# Altium schematic sheet SHIELD_TRF7960A.SchDoc
size A2
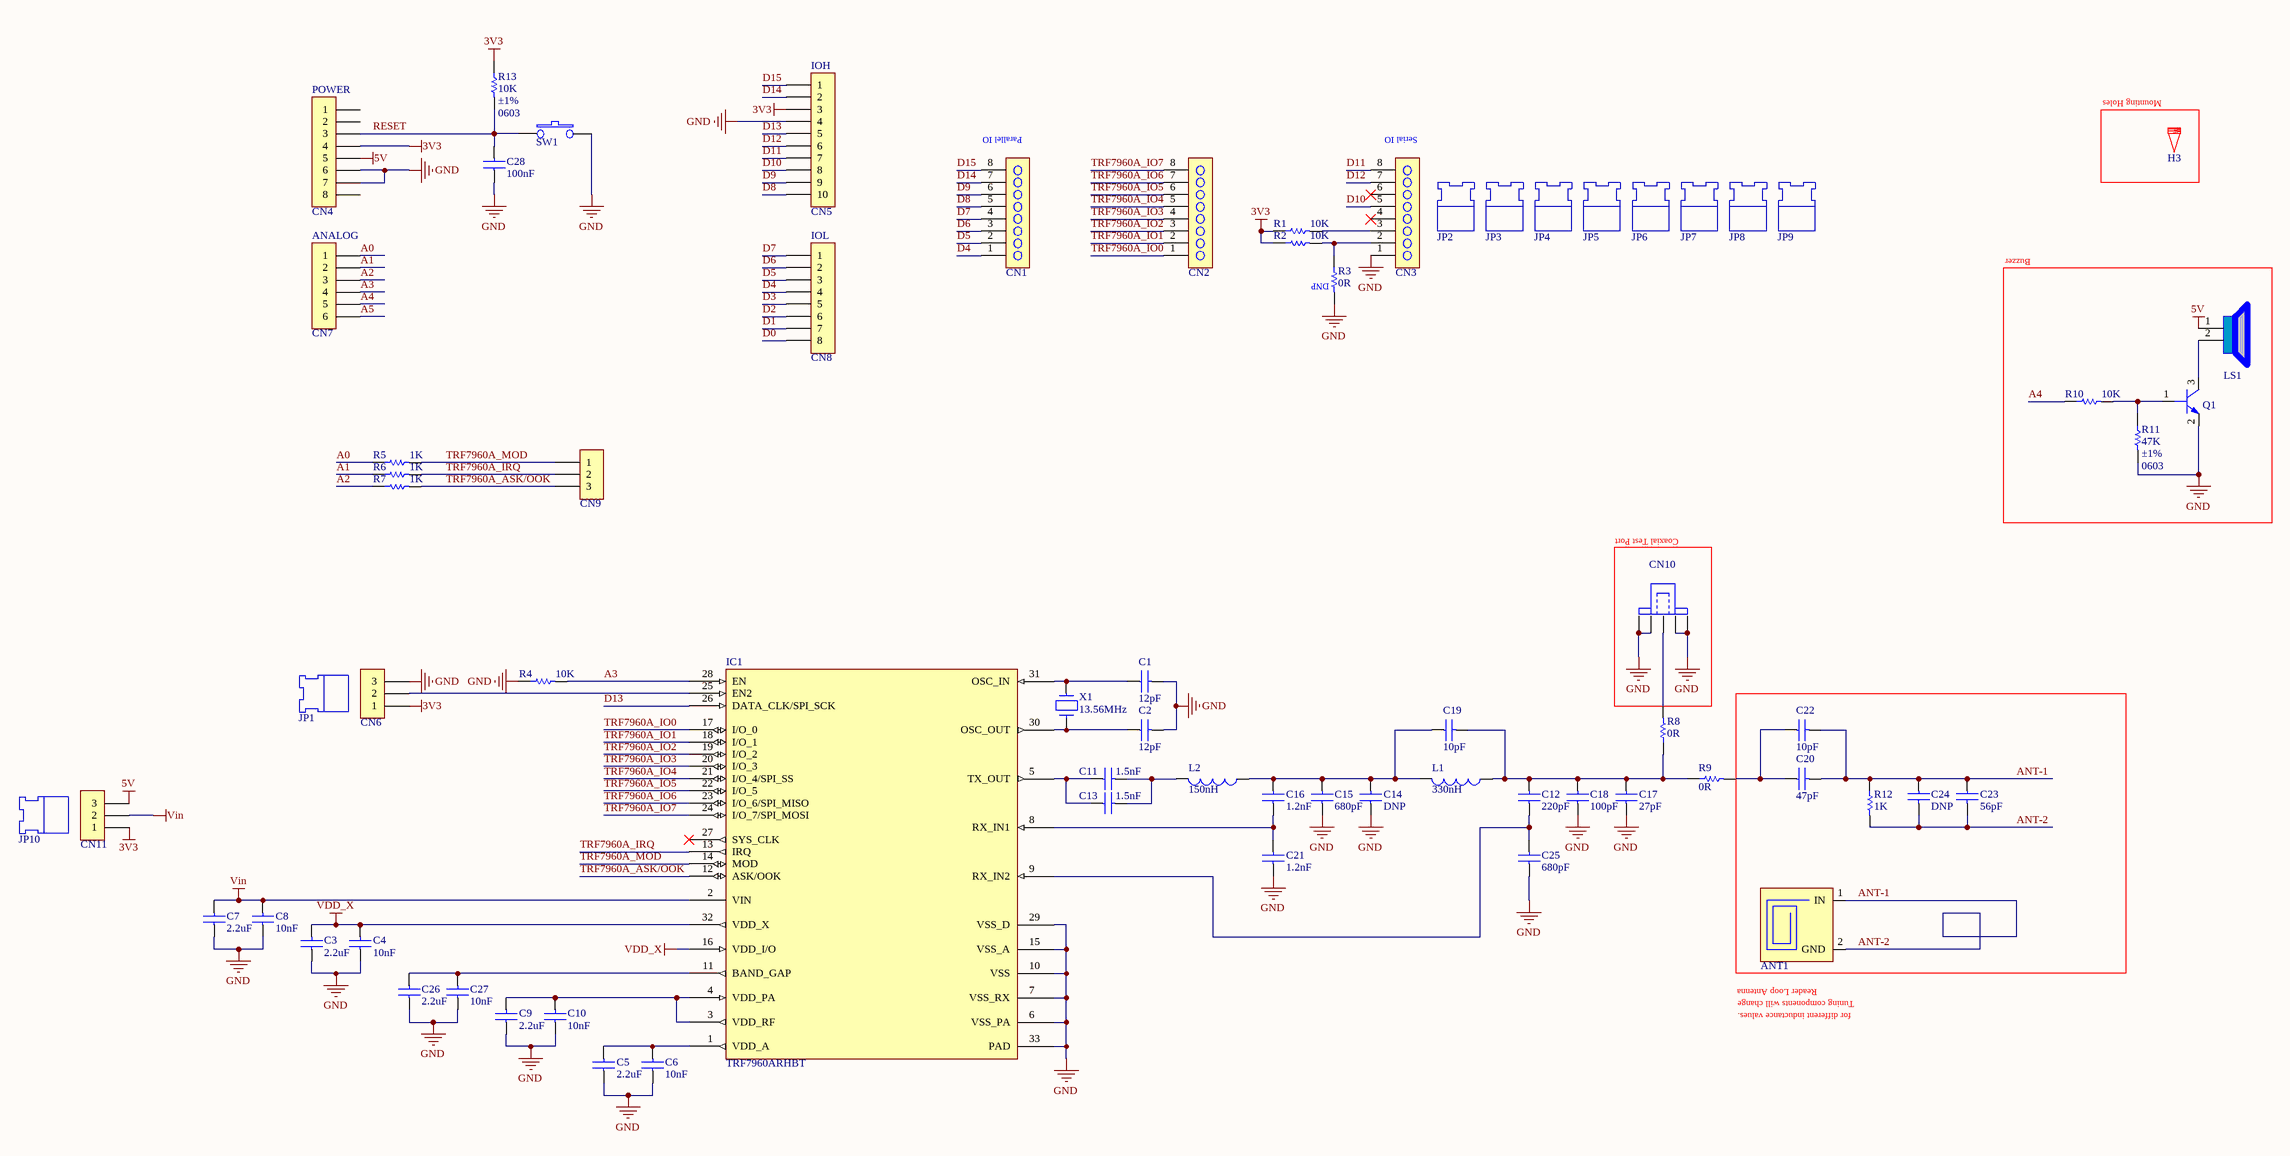
[diagram p0: SHIELD_TRF7960A.SchDoc]

## Parts
ANT1  ANTENNA_LOOP  [ANTENNA_LOOP]  (value not drawn)
C1  value 12pF  [CAPC1608X90N_EIA0603]  (hidden comment: CAP_NP)
C2  value 12pF  [CAPC1608X90N_EIA0603]  (hidden comment: CAP_NP)
C3  value 2.2uF  [CAPC1608X90N_EIA0603]  (hidden comment: CAP_NP)
C4  value 10nF  [CAPC1608X90N_EIA0603]  (hidden comment: CAP_NP)
C5  value 2.2uF  [CAPC1608X90N_EIA0603]  (hidden comment: CAP_NP)
C6  value 10nF  [CAPC1608X90N_EIA0603]  (hidden comment: CAP_NP)
C7  value 2.2uF  [CAPC1608X90N_EIA0603]  (hidden comment: CAP_NP)
C8  value 10nF  [CAPC1608X90N_EIA0603]  (hidden comment: CAP_NP)
C9  value 2.2uF  [CAPC1608X90N_EIA0603]  (hidden comment: CAP_NP)
C10  value 10nF  [CAPC1608X90N_EIA0603]  (hidden comment: CAP_NP)
C11  value 1.5nF  [CAPC1608X90N_EIA0603]  (hidden comment: CAP_NP)
C12  value 220pF  [CAPC1608X90N_EIA0603]  (hidden comment: CAP_NP)
C13  value 1.5nF  [CAPC1608X90N_EIA0603]  (hidden comment: CAP_NP)
C14  value DNP  [CAPC1608X90N_EIA0603]  (hidden comment: CAP_NP)
C15  value 680pF  [CAPC1608X90N_EIA0603]  (hidden comment: CAP_NP)
C16  value 1.2nF  [CAPC1608X90N_EIA0603]  (hidden comment: CAP_NP)
C17  value 27pF  [CAPC1608X90N_EIA0603]  (hidden comment: CAP_NP)
C18  value 100pF  [CAPC1608X90N_EIA0603]  (hidden comment: CAP_NP)
C19  value 10pF  [CAPC1608X90N_EIA0603]  (hidden comment: CAP_NP)
C20  value 47pF  [CAPC1608X90N_EIA0603]  (hidden comment: CAP_NP)
C21  value 1.2nF  [CAPC1608X90N_EIA0603]  (hidden comment: CAP_NP)
C22  value 10pF  [CAPC1608X90N_EIA0603]  (hidden comment: CAP_NP)
C23  value 56pF  [CAPC1608X90N_EIA0603]  (hidden comment: CAP_NP)
C24  value DNP  [CAPC1608X90N_EIA0603]  (hidden comment: CAP_NP)
C25  value 680pF  [CAPC1608X90N_EIA0603]  (hidden comment: CAP_NP)
C26  value 2.2uF  [CAPC1608X90N_EIA0603]  (hidden comment: CAP_NP)
C27  value 10nF  [CAPC1608X90N_EIA0603]  (hidden comment: CAP_NP)
C28  value 100nF  [CAPC1608X90N_EIA0603]  (hidden comment: CAP_NP)
CN1  HDRV_1X8  [HDRV8W64P254_1X8_2032X254X600P]  (value not drawn)
CN2  HDRV_1X8  [HDRV8W64P254_1X8_2032X254X600P]  (value not drawn)
CN3  HDRV_1X8  [HDRV8W64P254_1X8_2032X254X600P]  (value not drawn)
CN4  HDR_1X8  [HDRFV8W70P254_1X8_2032X254X1118P]  (value not drawn)
CN5  HDR_1X10  [HDRFV10W70P254_1X10_2540X254X1118P]  (value not drawn)
CN6  HDR_1X3  [HDRV3W64P254_1X3_762X254X600P]  (value not drawn)
CN7  HDR_1X6  [HDRFV6W70P254_1X6_1524X254X1118P]  (value not drawn)
CN8  HDR_1X8  [HDRFV8W70P254_1X8_2032X254X1118P]  (value not drawn)
CN9  HDR_1X3  [HDRV3W64P254_1X3_762X254X600P]  (value not drawn)
CN10  SMA  [EMERSON_142-0701-201]  (value not drawn)
CN11  HDR_1X3  [HDRV3W64P254_1X3_762X254X600P]  (value not drawn)
H3  HOLES  [HOLE_125MIL]  (value not drawn)
IC1  Manufacturer Part Number: TRF7960ARHBT  [QFN50P350X500X90_HS-33N]  (hidden comment: TRF7960A)
JP1  JUMPER  [JUMPER254P]  (value not drawn)
JP2  JUMPER  [JUMPER254P]  (value not drawn)
JP3  JUMPER  [JUMPER254P]  (value not drawn)
JP4  JUMPER  [JUMPER254P]  (value not drawn)
JP5  JUMPER  [JUMPER254P]  (value not drawn)
JP6  JUMPER  [JUMPER254P]  (value not drawn)
JP7  JUMPER  [JUMPER254P]  (value not drawn)
JP8  JUMPER  [JUMPER254P]  (value not drawn)
JP9  JUMPER  [JUMPER254P]  (value not drawn)
JP10  JUMPER  [JUMPER254P]  (value not drawn)
L1  value 330nH  [INDC2115X13N_EIA0805]  (hidden comment: INDUCTOR)
L2  value 150nH  [INDC2115X13N_EIA0805]  (hidden comment: INDUCTOR)
LS1  BUZZER  [BUZZER_12MM]  (value not drawn)
Q1  BC817  [SOT95P230X110-3N_SOT-23]  (value not drawn)
R1  value 10K  [RESC1608X50N_EIA0603]  (hidden comment: RES)
R2  value 10K  [RESC1608X50N_EIA0603]  (hidden comment: RES)
R3  value 0R  [RESC1608X50N_EIA0603]  (hidden comment: RES)
R4  value 10K  [RESC1608X50N_EIA0603]  (hidden comment: RES)
R5  value 1K  [RESC1608X50N_EIA0603]  (hidden comment: RES)
R6  value 1K  [RESC1608X50N_EIA0603]  (hidden comment: RES)
R7  value 1K  [RESC1608X50N_EIA0603]  (hidden comment: RES)
R8  value 0R  [RESC1608X50N_EIA0603]  (hidden comment: RES)
R9  value 0R  [RESC1608X50N_EIA0603]  (hidden comment: RES)
R10  value 10K  [RESC1608X50N_EIA0603]  (hidden comment: RES)
R11  value 47K  Tolerance: ±1%  Package / Case: 0603  [RESC1608X50N_EIA0603]  (hidden comment: RES)
R12  value 1K  [RESC1608X50N_EIA0603]  (hidden comment: RES)
R13  value 10K  Tolerance: ±1%  Package / Case: 0603  [RESC1608X50N_EIA0603]  (hidden comment: RES)
SW1  SWITCH_TACTILE_2PIN  [C&K_RS-282G05A3-SM_RT]  (value not drawn)
X1  value 13.56MHz  [HC-49/US]  (hidden comment: CRYSTAL)

## Blocks framed on the sheet
Mounting Holes: H3
Buzzer: LS1 Q1 R10 R11
Coaxial Test Port: CN10

## Nets
3V3: CN4.4 CN5.3 CN6.1 CN11.1 R1.1 R2.1 R13.1
5V: CN4.5 CN11.3 LS1.1(+)
GND: C1.2 C2.2 C3.1 C4.1 C5.1 C6.1 C7.1 C8.1 C9.1 C10.1 C14.1 C15.1 C17.1 C18.1 C21.1 C25.1 C26.1 C27.1 C28.1 CN3.1 CN4.6 CN4.7 CN5.4 CN6.3 CN10.2 CN10.3 CN10.4 CN10.5 IC1.6(VSS_PA) IC1.7(VSS_RX) IC1.10(VSS) IC1.15(VSS_A) IC1.29(VSS_D) IC1.33(PAD) Q1.2(E) R3.2 R4.1 R11.2 SW1.2
VDD_X: C3.2 C4.2 IC1.16(VDD_I/O) IC1.32(VDD_X)
Vin: C7.2 C8.2 CN11.2 IC1.2(VIN)
A0: CN7.1 R5.1
A1: CN7.2 R6.1
A2: CN7.3 R7.1
A3: CN7.4 IC1.28(EN) R4.2
A4: CN7.5 R10.1
A5: CN7.6
ANT-1: ANT1.1(IN) ANT1.2(GND) C20.2 C22.2 C23.1 C23.2 C24.1 C24.2 R12.1 R12.2  [also labelled ANT-2]
D0: CN8.8
D1: CN8.7
D2: CN8.6
D3: CN8.5
D4: CN1.1 CN8.4
D5: CN1.2 CN8.3
D6: CN1.3 CN8.2
D7: CN1.4 CN8.1
D8: CN1.5 CN5.10
D9: CN1.6 CN5.9
D10: CN3.5 CN5.8
D11: CN3.8 CN5.7
D12: CN3.7 CN5.6
D13: CN5.5 IC1.26(DATA_CLK/SPI_SCK)
D14: CN1.7 CN5.2
D15: CN1.8 CN5.1
RESET: C28.2 CN4.3 R13.2 SW1.1
TRF7960A_ASK/OOK: CN9.3 IC1.12(ASK/OOK) R7.2
TRF7960A_IO0: CN2.1 IC1.17(I/O_0)
TRF7960A_IO1: CN2.2 IC1.18(I/O_1)
TRF7960A_IO2: CN2.3 IC1.19(I/O_2)
TRF7960A_IO3: CN2.4 IC1.20(I/O_3)
TRF7960A_IO4: CN2.5 IC1.21(I/O_4/SPI_SS)
TRF7960A_IO5: CN2.6 IC1.22(I/O_5)
TRF7960A_IO6: CN2.7 IC1.23(I/O_6/SPI_MISO)
TRF7960A_IO7: CN2.8 IC1.24(I/O_7/SPI_MOSI)
TRF7960A_IRQ: CN9.2 IC1.13(IRQ) R6.2
TRF7960A_MOD: CN9.1 IC1.14(MOD) R5.2
NetC1_1: C1.1 IC1.31(OSC_IN) X1.1
NetC2_1: C2.1 IC1.30(OSC_OUT) X1.2
NetC5_2: C5.2 C6.2 IC1.1(VDD_A)
NetC9_2: C9.2 C10.2 IC1.3(VDD_RF) IC1.4(VDD_PA)
NetC11_1: C11.1 C13.1 IC1.5(TX_OUT)
NetC11_2: C11.2 C13.2 L2.2
NetC12_1: C12.1 C25.2 IC1.9(RX_IN2)
NetC12_2: C12.2 C17.2 C18.2 C19.2 L1.1 R8.1 R9.1
NetC14_2: C14.2 C15.2 C16.2 C19.1 L1.2 L2.1
NetC16_1: C16.1 C21.2 IC1.8(RX_IN1)
NetC20_1: C20.1 C22.1 R9.2
NetC26_2: C26.2 C27.2 IC1.11(BAND_GAP)
NetCN3_2: CN3.2 R2.2 R3.1
NetCN3_3: CN3.3 R1.2
NetCN6_2: CN6.2 IC1.25(EN2)
NetCN10_1: CN10.1 R8.2
NetLS1_2: LS1.2(-) Q1.3(C)
NetQ1_1: Q1.1(B) R10.2 R11.1

Not connected (* = marked no-connect by the designer): CN3 4* 6*; CN4 1 2 8; IC1 27(SYS_CLK)*

## Notes on the sheet
- (near CN5) IOH
- (near CN4) POWER
- (near CN1) Parallel IO
- (near CN3) Serial IO
- (near CN7) ANALOG
- (near CN8) IOL
- (near R3) DNP
- (near ANT1) Reader Loop Antenna
- Tuning components will change
- for different inductance values.

## Library data of the parts
ANT1 = SMSC00004: ANTENNA LOOP; Part Number: SMSC00004; Value: ANTENNA
C1 C2 = SCAP00200035: CAP CER 12PF 50V NP0 0603; Manufacturer: Murata Electronics North America; Manufacturer Part Number: GRM1885C1H120JA01D; Tolerance: ±5%; Temperature Coefficient: C0G, NP0; Type: Multi Layer Ceramic Capacitor  (MLCC); Cost x1 ($): 0.10000; Cost x10 ($): 0.04100; Cost x100 ($): 0.01870; Cost x1000 ($): 0.01020; Distrubutor: Digikey; Lead Time: 19 Weeks; Part Number: SCAP00200035; Capacitance: 12pF; Voltage - Rated: 50V; Package / Case: 0603; Operating Temperature: -55°C ~ 125°C; Mounting Type: Surface Mount, MLCC; Size / Dimension: 0.063" L x 0.031" W (1.60mm x 0.80mm); Category: Capacitors; Family: Ceramic Capacitors; Distributor Part Number: 490-1405-1-ND; Distributor Link: http://www.digikey.com/product-detail/en/murata-electronics-north-america/GRM1885C1H120JA01D/490-1405-1-ND/587644; ROHS: YES; Moisture Sensitivity Level (MSL): 1 (Unlimited); Quantity: 0
C3 C5 C7 C9 C26 = SCAP00200098: CAP CER 2.2UF 6.3V X5R 0603; Manufacturer: Murata Electronics North America; Manufacturer Part Number: GRM188R60J225KE19D; Capacitance: 2.2µF; Tolerance: ±10%; Type: Multi Layer Ceramic Capacitor  (MLCC); Cost x1 ($): 0.13000; Cost x10 ($): 0.08800; Cost x100 ($): 0.04180; Cost x1000 ($): 0.02420; Distrubutor: Digikey; Lead Time: 19 Weeks; Part Number: SCAP00200098; Voltage - Rated: 6.3V; Package / Case: 0603; Temperature Coefficient: X5R; Operating Temperature: -55°C ~ 85°C; Mounting Type: Surface Mount, MLCC; Size / Dimension: 0.063" L x 0.031" W (1.60mm x 0.80mm); Category: Capacitors; Family: Ceramic Capacitors; Distributor Part Number: 490-1552-1-ND; Distributor Link: http://www.digikey.com/product-detail/en/murata-electronics-north-america/GRM188R60J225KE19D/490-1552-1-ND/587757; ROHS: YES; Moisture Sensitivity Level (MSL): 1 (Unlimited); Quantity: 0
C4 C6 C8 C10 C27 = SCAP00200083: CAP CER 10000PF 50V X7R 0603; Manufacturer: Murata Electronics North America; Manufacturer Part Number: GRM188R71H103KA01D; Tolerance: ±10%; Type: Multi Layer Ceramic Capacitor  (MLCC); Cost x1 ($): 0.10000; Cost x10 ($): 0.01900; Cost x100 ($): 0.00850; Cost x1000 ($): 0.00465; Distrubutor: Digikey; Lead Time: 19 Weeks; Part Number: SCAP00200083; Capacitance: 10nF; Voltage - Rated: 50V; Package / Case: 0603; Temperature Coefficient: X7R; Operating Temperature: -55°C ~ 125°C; Mounting Type: Surface Mount, MLCC; Size / Dimension: 0.063" L x 0.031" W (1.60mm x 0.80mm); Category: Capacitors; Family: Ceramic Capacitors; Distributor Part Number: 490-1512-1-ND; Distributor Link: http://www.digikey.com/product-detail/en/murata-electronics-north-america/GRM188R71H103KA01D/490-1512-1-ND/587862; ROHS: YES; Moisture Sensitivity Level (MSL): 1 (Unlimited); Quantity: 0
C11 C13 = SCAP00200075: CAP CER 1500PF 50V X7R 0603; Manufacturer: Murata Electronics North America; Manufacturer Part Number: GRM188R71H152KA01D; Tolerance: ±10%; Type: Multi Layer Ceramic Capacitor  (MLCC); Cost x1 ($): 0.10000; Cost x10 ($): 0.03500; Cost x100 ($): 0.01600; Cost x1000 ($): 0.00873; Distrubutor: Digikey; Lead Time: 19 Weeks; Part Number: SCAP00200075; Capacitance: 1.5nF; Voltage - Rated: 50V; Package / Case: 0603; Temperature Coefficient: X7R; Operating Temperature: -55°C ~ 125°C; Mounting Type: SMD; Size / Dimension: 0.063" L x 0.031" W (1.60mm x 0.80mm); Category: Capacitors; Family: Ceramic Capacitors; Distributor Part Number: 490-1498-1-ND; Distributor Link: http://www.digikey.com/product-detail/en/murata-electronics-north-america/GRM188R71H152KA01D/490-1498-1-ND/587878; ROHS: YES; Moisture Sensitivity Level (MSL): 1 (Unlimited); Quantity: 0
C12 = SCAP00200065: CAP CER 220PF 50V NP0 0603; Manufacturer: Murata Electronics North America; Manufacturer Part Number: GRM1885C1H221JA01D; Tolerance: ±5%; Temperature Coefficient: C0G, NP0; Type: Multi Layer Ceramic Capacitor  (MLCC); Cost x1 ($): 0.10000; Cost x10 ($): 0.04100; Cost x100 ($): 0.01870; Cost x1000 ($): 0.01020; Distrubutor: Digikey; Lead Time: 19 Weeks; Part Number: SCAP00200065; Capacitance: 220pF; Voltage - Rated: 50V; Package / Case: 0603; Operating Temperature: -55°C ~ 125°C; Mounting Type: SMD; Size / Dimension: 0.063" L x 0.031" W (1.60mm x 0.80mm); Category: Capacitors; Family: Ceramic Capacitors; Distributor Part Number: 490-1435-1-ND; Distributor Link: http://www.digikey.com/product-detail/en/murata-electronics-north-america/GRM1885C1H221JA01D/490-1435-1-ND/587673; ROHS: YES; Moisture Sensitivity Level (MSL): 1 (Unlimited); Quantity: 0
C14 C24 = SCAP00200000: Type: Multi Layer Ceramic Capacitor  (MLCC); Distrubutor: Digikey; Part Number: SCAP00200000; Capacitance: DNP; Package / Case: 0603; Category: Capacitors; Family: Ceramic Capacitors; ROHS: YES; Quantity: 0
C15 C25 = SCAP00200071: CAP CER 680PF 50V NP0 0603; Manufacturer: Murata Electronics North America; Manufacturer Part Number: GRM1885C1H681JA01D; Tolerance: ±5%; Temperature Coefficient: C0G, NP0; Type: Multi Layer Ceramic Capacitor  (MLCC); Cost x1 ($): 0.10000; Cost x10 ($): 0.06600; Cost x100 ($): 0.03040; Cost x1000 ($): 0.01659; Distrubutor: Digikey; Lead Time: 17 Weeks; Part Number: SCAP00200071; Capacitance: 680pF; Voltage - Rated: 50V; Package / Case: 0603; Operating Temperature: -55°C ~ 125°C; Mounting Type: SMD; Size / Dimension: 0.063" L x 0.031" W (1.60mm x 0.80mm); Category: Capacitors; Family: Ceramic Capacitors; Distributor Part Number: 490-1447-1-ND; Distributor Link: http://www.digikey.com/product-detail/en/murata-electronics-north-america/GRM1885C1H681JA01D/490-1447-1-ND/587664; ROHS: YES; Moisture Sensitivity Level (MSL): 1 (Unlimited); Quantity: 0
C16 C21 = SCAP00200074: CAP CER 1200PF 50V X7R 0603; Manufacturer: Murata Electronics North America; Manufacturer Part Number: GRM188R71H122KA01D; Tolerance: ±10%; Type: Multi Layer Ceramic Capacitor  (MLCC); Cost x1 ($): 0.10000; Cost x10 ($): 0.05600; Cost x100 ($): 0.02590; Cost x1000 ($): 0.01410; Distrubutor: Digikey; Lead Time: 19 Weeks; Part Number: SCAP00200074; Capacitance: 1.2nF; Voltage - Rated: 50V; Package / Case: 0603; Temperature Coefficient: X7R; Operating Temperature: -55°C ~ 125°C; Mounting Type: SMD; Size / Dimension: 0.063" L x 0.031" W (1.60mm x 0.80mm); Category: Capacitors; Family: Ceramic Capacitors; Distributor Part Number: 490-1496-1-ND; Distributor Link: http://www.digikey.com/product-detail/en/murata-electronics-north-america/GRM188R71H122KA01D/490-1496-1-ND/587853; ROHS: YES; Moisture Sensitivity Level (MSL): 1 (Unlimited); Quantity: 0
C17 = SCAP00200043: CAP CER 27PF 50V NP0 0603; Manufacturer: Murata Electronics North America; Manufacturer Part Number: GRM1885C1H270JA01D; Tolerance: ±5%; Temperature Coefficient: C0G, NP0; Type: Multi Layer Ceramic Capacitor  (MLCC); Cost x1 ($): 0.10000; Cost x10 ($): 0.04100; Cost x100 ($): 0.01870; Cost x1000 ($): 0.01020; Distrubutor: Digikey; Lead Time: 19 Weeks; Part Number: SCAP00200043; Capacitance: 27pF; Voltage - Rated: 50V; Package / Case: 0603; Operating Temperature: -55°C ~ 125°C; Mounting Type: SMD; Size / Dimension: 0.063" L x 0.031" W (1.60mm x 0.80mm); Category: Capacitors; Family: Ceramic Capacitors; Distributor Part Number: 490-1413-1-ND; Distributor Link: http://www.digikey.com/product-detail/en/murata-electronics-north-america/GRM1885C1H270JA01D/490-1413-1-ND/587618; ROHS: YES; Moisture Sensitivity Level (MSL): 1 (Unlimited); Quantity: 0
C18 = SCAP00200057: CAP CER 100PF 50V NP0 0603; Manufacturer: Murata Electronics North America; Manufacturer Part Number: GRM1885C1H101JA01D; Tolerance: ±5%; Temperature Coefficient: C0G, NP0; Type: Multi Layer Ceramic Capacitor  (MLCC); Cost x1 ($): 0.10000; Cost x10 ($): 0.03100; Cost x100 ($): 0.01400; Cost x1000 ($): 0.00765; Distrubutor: Digikey; Lead Time: 19 Weeks; Part Number: SCAP00200057; Capacitance: 100pF; Voltage - Rated: 50V; Package / Case: 0603; Operating Temperature: -55°C ~ 125°C; Mounting Type: SMD; Size / Dimension: 0.063" L x 0.031" W (1.60mm x 0.80mm); Category: Capacitors; Family: Ceramic Capacitors; Distributor Part Number: 490-1427-1-ND; Distributor Link: http://www.digikey.com/product-detail/en/murata-electronics-north-america/GRM1885C1H101JA01D/490-1427-1-ND/587633; ROHS: YES; Moisture Sensitivity Level (MSL): 1 (Unlimited); Quantity: 0
C19 C22 = SCAP00200033: CAP CER 10PF 50V NP0 0603; Manufacturer: Murata Electronics North America; Manufacturer Part Number: GCM1885C1H100JA16D; Tolerance: ±5%; Temperature Coefficient: C0G, NP0; Type: Multi Layer Ceramic Capacitor  (MLCC); Cost x1 ($): 0.10000; Cost x10 ($): 0.04200; Cost x100 ($): 0.01930; Cost x1000 ($): 0.01050; Distrubutor: Digikey; Lead Time: 19 Weeks; Part Number: SCAP00200033; Capacitance: 10pF; Voltage - Rated: 50V; Package / Case: 0603; Operating Temperature: -55°C ~ 125°C; Mounting Type: SMD; Size / Dimension: 0.063" L x 0.031" W (1.60mm x 0.80mm); Category: Capacitors; Family: Ceramic Capacitors; Distributor Part Number: 490-4766-1-ND; Distributor Link: http://www.digikey.com/product-detail/en/murata-electronics-north-america/GCM1885C1H100JA16D/490-4766-1-ND/1641685; ROHS: YES; Moisture Sensitivity Level (MSL): 1 (Unlimited); Quantity: 0
C20 = SCAP00200049: CAP CER 47PF 50V NP0 0603; Manufacturer: Murata Electronics North America; Manufacturer Part Number: GRM1885C1H470JA01D; Tolerance: ±5%; Temperature Coefficient: C0G, NP0; Type: Multi Layer Ceramic Capacitor  (MLCC); Cost x1 ($): 0.10000; Cost x10 ($): 0.02900; Cost x100 ($): 0.01320; Cost x1000 ($): 0.00720; Distrubutor: Digikey; Lead Time: 19 Weeks; Part Number: SCAP00200049; Capacitance: 47pF; Voltage - Rated: 50V; Package / Case: 0603; Operating Temperature: -55°C ~ 125°C; Mounting Type: SMD; Size / Dimension: 0.063" L x 0.031" W (1.60mm x 0.80mm); Category: Capacitors; Family: Ceramic Capacitors; Distributor Part Number: 490-1419-1-ND; Distributor Link: http://www.digikey.com/product-detail/en/murata-electronics-north-america/GRM1885C1H470JA01D/490-1419-1-ND/587616; ROHS: YES; Moisture Sensitivity Level (MSL): 1 (Unlimited); Quantity: 0
C23 = SCAP00200051: CAP CER 56PF 50V NP0 0603; Manufacturer: Murata Electronics North America; Manufacturer Part Number: GRM1885C1H560JA01D; Tolerance: ±5%; Temperature Coefficient: C0G, NP0; Type: Multi Layer Ceramic Capacitor  (MLCC); Cost x1 ($): 0.10000; Cost x10 ($): 0.04100; Cost x100 ($): 0.01870; Cost x1000 ($): 0.01020; Distrubutor: Digikey; Lead Time: 19 Weeks; Part Number: SCAP00200051; Capacitance: 56pF; Voltage - Rated: 50V; Package / Case: 0603; Operating Temperature: -55°C ~ 125°C; Mounting Type: SMD; Size / Dimension: 0.063" L x 0.031" W (1.60mm x 0.80mm); Category: Capacitors; Family: Ceramic Capacitors; Distributor Part Number: 490-1421-1-ND; Distributor Link: http://www.digikey.com/product-detail/en/murata-electronics-north-america/GRM1885C1H560JA01D/490-1421-1-ND/587626; ROHS: YES; Moisture Sensitivity Level (MSL): 1 (Unlimited); Quantity: 0
C28 = SCAP00200091: CAP CER 0.1UF 16V X7R 0603; Manufacturer: Murata Electronics North America; Manufacturer Part Number: GRM188R71C104KA01D; Tolerance: ±10%; Type: Multi Layer Ceramic Capacitor  (MLCC); Cost x1 ($): 0.10000; Cost x10 ($): 0.01900; Cost x100 ($): 0.00860; Cost x1000 ($): 0.00468; Distrubutor: Digikey; Lead Time: 11 Weeks; Part Number: SCAP00200091; Capacitance: 100nF; Voltage - Rated: 16V; Package / Case: 0603; Temperature Coefficient: X7R; Operating Temperature: -55°C ~ 125°C; Mounting Type: Surface Mount, MLCC; Size / Dimension: 0.063" L x 0.031" W (1.60mm x 0.80mm); Category: Capacitors; Family: Ceramic Capacitors; Distributor Part Number: 490-1532-1-ND; Distributor Link: http://www.digikey.com/product-detail/en/murata-electronics-north-america/GRM188R71C104KA01D/490-1532-1-ND/587771; ROHS: YES; Moisture Sensitivity Level (MSL): 1 (Unlimited); Quantity: 0
CN1-CN3 = SCON00132: CONN HEADER 8POS .100 VERT TIN; Manufacturer: Harwin Inc.; Manufacturer Part Number: M20-9990846; Value: HDR_M_1X8_254; Pitch: 2.54mm; Connector Type: Male Pin; Distrubutor: Digikey; Lead Time: 6 Weeks; Cost x1 ($): 0.23000; Cost x10 ($): 0.20400; Cost x100 ($): 0.16800; Cost x1000 ($): 0.11400; Part Number: SCON00132; Category: Connectors, Interconnects; Family: Rectangular Connectors - Headers, Male Pins; Contact Type: Header, Unshrouded; Mounting Type: Through Hole; Distributor Part Number: 952-2271-ND; Datasheet Link: http://www.digikey.com/product-detail/en/harwin-inc/M20-9990846/952-2271-ND/3728235; ROHS: YES; Moisture Sensitivity Level (MSL): 1 (Unlimited); Part Status: Active; Quantity: 0
CN4 CN8 = SCON00125: CONN ARDUINO HEADER .0100" 8POS; Manufacturer: Sparkfun; Manufacturer Part Number: PRT-09279; Pitch: 2.54mm; Connector Type: Stackable Header; Cost x1 ($): 0.50; Cost x100 ($): 0.48; Cost x1000 ($): 0.45; Part Number: SCON00125; Value: HDR_1X8; Category: Connectors, Interconnects; Family: Rectangular Connectors - Headers, Receptacles, Female Sockets; Contact Type: Female Socket; Mounting Type: Through Hole; Distrubutor: Sparkfun; Distributor Part Number: PRT-09279; Datasheet Link: https://www.sparkfun.com/products/9279; ROHS: YES; Quantity: 10; Cost x10 ($): 0.50
CN5 = SCON00126: CONN ARDUINO HEADER .0100" 10POS; Manufacturer: Sparkfun; Manufacturer Part Number: PRT-11376; Pitch: 2.54mm; Connector Type: Stackable Header; Cost x1 ($): 0.50; Cost x100 ($): 0.48; Cost x1000 ($): 0.45; Part Number: SCON00126; Value: HDR_1X10; Category: Connectors, Interconnects; Family: Rectangular Connectors - Headers, Receptacles, Female Sockets; Contact Type: Female Socket; Mounting Type: Through Hole; Distrubutor: Sparkfun; Distributor Part Number: PRT-11376; Datasheet Link: https://www.sparkfun.com/products/11376; ROHS: YES; Quantity: 10; Cost x10 ($): 0.50
CN6 CN9 CN11 = SCON00131: CONN HEADER MALE 3PS .1" DL TIN; Manufacturer: Wurth Electronics Inc; Manufacturer Part Number: 61300311121; Pitch: 2.54mm; Connector Type: Male Pin; Distrubutor: Digikey; Cost x1 ($): 0.13000; Cost x10 ($): 0.10600; Cost x100 ($): 0.06700; Cost x1000 ($): 0.06100; Part Number: SCON00131; Value: HDR_1X3; Category: Connectors, Interconnects; Family: Rectangular Connectors - Headers, Male Pins; Contact Type: Header, Unshrouded; Mounting Type: Through Hole; Distributor Part Number: 732-5316-ND; Datasheet Link: http://www.digikey.com/product-detail/en/wurth-electronics-inc/61300311121/732-5316-ND/4846825; ROHS: YES; Quantity: 0
CN7 = SCON00124: CONN ARDUINO HEADER .0100" 6POS; Manufacturer: Sparkfun; Manufacturer Part Number: PRT-09280; Pitch: 2.54mm; Connector Type: Stackable Header; Cost x1 ($): 0.50; Cost x100 ($): 0.48; Cost x1000 ($): 0.45; Part Number: SCON00124; Value: HDR_1X6; Category: Connectors, Interconnects; Family: Rectangular Connectors - Headers, Receptacles, Female Sockets; Contact Type: Female Socket; Mounting Type: Through Hole; Distrubutor: Sparkfun; Distributor Part Number: PRT-09280; Datasheet Link: https://www.sparkfun.com/products/9280; ROHS: YES; Quantity: 10; Cost x10 ($): 0.50
CN10 = SCON00009: CONN SMA JACK STR 50 OHM PCB; Manufacturer: Emerson Network Power Connectivity Johnson; Manufacturer Part Number: 142-0701-201; Value: SMA_FEMALE_STRAIGHT; Connector Type: SMA - Jack, Female Socket; Distrubutor: Digikey; Cost x1 ($): 4.68000; Cost x10 ($): 4.16500; Cost x100 ($): 3.06000; Cost x1000 ($): 2.12500; Part Number: SCON00009; Category: Connectors, Interconnects; Family: Coaxial Connectors (RF); Mounting Type: Through Hole; Packaging: Bulk; Distributor Part Number: J500-ND; Datasheet Link: http://www.digikey.com/product-detail/en/142-0701-201/J500-ND/35274; ROHS: YES; Quantity: 0
H3 = SMSC00005: Value: HOLE_125MIL; Part Number: SMSC00005
IC1 = SIC00130: IC RFID AFE 13.56MHZ 32QFN; Manufacturer: Texas Instruments; Vin: 2.7 V ~ 5.5 V; Protocol: SPI; Cost x10 ($): 6.67000; Cost x100 ($): 5.51000; Cost x1000 ($): 4.20500; Distrubutor: Digikey; Cost x1 ($): 7.40000; Part Number: SIC00130; Value: TRF7960A; Speed: 13.56MHz; Operating Temperature: -40°C ~ 110°C; Category: Integrated Circuits (ICs); Family: RF/IF and RFID; Package / Case: 32-VFQFN Exposed Pad; Type: ISO 14443A/B, ISO 15693, ISO 18000-3, NFC, Felica; Distributor Part Number: 296-29381-2-ND; ROHS: YES; Distributor Link: http://www.digikey.com/product-detail/en/texas-instruments/TRF7960ARHBT/296-29381-2-ND/2697046; Quantity: 10
JP1-JP10 = SCON00007: SHUNT JUMPER .1" BLACK GOLD; Manufacturer: 3M; Manufacturer Part Number: 969102-0000-DA; Pitch: 0.100" (2.54mm); Connector Type: Open Top; Distrubutor: Digikey; Cost x1 ($): 0.10000; Cost x10 ($): 0.09400; Cost x100 ($): 0.05800; Cost x1000 ($): 0.04200; Part Number: SCON00007; Value: JUMPER; Category: Connectors, Interconnects; Family: Shunts, Jumpers; Mounting Type: Through Hole, Right Angle; Distributor Part Number: 3M9580-ND; Datasheet Link: http://www.digikey.com/product-detail/en/969102-0000-DA/3M9580-ND/2071621; ROHS: YES; Quantity: 110
L1 = SIND00005: FIXED IND 330NH 300MA 1.28 OHM; Manufacturer: Pulse Electronics Corporation; Manufacturer Part Number: PE-0805CM331JTT; Tolerance: ±5%; DC Resistance (DCR): 1.28 Ohm Max; Q @ Freq: 40 @ 100MHz; Type: Wirewound; Distrubutor: Digikey; Lead Time: 8 Weeks; Cost x10 ($): 0.36000; Cost x100 ($): 0.26000; Cost x1000 ($): 0.18400; Cost x1 ($): 0.40000; Part Number: SIND00005; Inductance: 330nH; Package / Case: 0805 (2012 Metric); Operating Temperature: -40°C ~ 125°C; Current Rating: 300mA; Category: Inductors, Coils, Chokes; Family: Fixed Inductors; Distributor Part Number: 553-1045-1-ND; Distributor Link: http://www.digikey.com/product-detail/en/pulse-electronics-corporation/PE-0805CM331JTT/553-1045-1-ND/754464; ROHS: YES; Moisture Sensitivity Level (MSL): 1 (Unlimited)
L2 = SIND00004: FIXED IND 150NH 400MA 670 MOHM; Manufacturer: Bourns Inc.; Manufacturer Part Number: CW201212-R15J; Tolerance: ±5%; Q @ Freq: 50 @ 250MHz; Type: Wirewound; Distrubutor: Digikey; Lead Time: 16 Weeks; Cost x10 ($): 0.25600; Cost x100 ($): 0.18460; Cost x1000 ($): 0.13064; Cost x1 ($): 0.28000; Part Number: SIND00004; Inductance: 150nH; DC Resistance (DCR): 670 mOhm; Package / Case: 0805 (2012 Metric); Operating Temperature: -40°C ~ 125°C; Current Rating: 400mA; Category: Inductors, Coils, Chokes; Family: Fixed Inductors; Distributor Part Number: CW201212-R15JCT-ND; Distributor Link: http://www.digikey.com/product-detail/en/bourns-inc/CW201212-R15J/CW201212-R15JCT-ND/3741341; ROHS: YES; Moisture Sensitivity Level (MSL): 1 (Unlimited)
LS1 = SAUD00001: AUDIO MAGNETIC INDICATOR 4-7V TH; Manufacturer: CUI Inc.; Manufacturer Part Number: CEM-1205C; Voltage: 5VDC; Iin: 35mA; Frequency: 2.3kHz; Cost x10 ($): 2.08200; Cost x100 ($): 1.54200; Cost x1000 ($): 1.11795; Distrubutor: Digikey; Lead Time: 13 Weeks; Cost x1 ($): 2.51000; Part Number: SAUD00001; Value: BUZZER; Size / Dimension: 12.0mm Dia x 10.0mm H; Category: Audio Products; Family: Buzzers; Type: Indicator, Internally Driven; Distributor Part Number: 102-1124-ND; ROHS: YES; Datasheet Link: http://www.digikey.com/product-detail/en/cui-inc/CEM-1205C/102-1124-ND/412383; Moisture Sensitivity Level (MSL): 1 (Unlimited); Quantity: 20; Active: Active
Q1 = STRANS00034: TRANS NPN 45V 0.5A SOT23; Manufacturer: NXP Semiconductors; Manufacturer Part Number: BC817-40,215; Value: BC817-40; Ic (Max): 500mA; Vce Saturation (Max) @ Ib, Ic: 700mV @ 50mA, 500mA; Ic Cutoff (Max): 100nA (ICBO); hFE (Min) @ Ic, Vce: 250 @ 100mA, 1V; Power - Max: 250mW; Frequency - Transition: 100MHz; Cost x10 ($): 0.12700; Cost x100 ($): 0.06930; Cost x1000 ($): 0.02905; Distrubutor: Digikey; Lead Time: 6 Weeks; Cost x1 ($): 0.14000; Part Number: STRANS00034; Vce Breakdown (Max): 45V; Mounting Type: SMD; Category: Discrete Semiconductor Products; Family: Transistors (BJT) - Single; Transistor Type: NPN; Package / Case: SOT-23-3, TO-236-3, SC-59; Distributor Part Number: 568-1631-1-ND; ROHS: YES; Datasheet Link: http://www.digikey.com/product-detail/en/nxp-semiconductors/BC817-40,215/568-1631-1-ND/763458; Quantity: 110
R1 R2 R4 R10 R13 = SRES02000098: RES SMD 10K OHM 1% 1/10W 0603; Manufacturer: Yageo; Manufacturer Part Number: RC0603FR-0710KL; Power (Watts): 0.1W, 1/10W; Cost x1 ($): 0.10000; Cost x10 ($): 0.01400; Cost x100 ($): 0.00570; Cost x1000 ($): 0.00257; Distrubutor: Digikey; Lead Time: 22 Weeks; Part Number: SRES02000098; Resistance (Ohm): 10K; Category: Resistors; Family: Chip Resistor - Surface Mount; Distributor Part Number: 311-10.0KHRCT-ND; Distributor Link: http://www.digikey.com/product-detail/en/yageo/RC0603FR-0710KL/311-10.0KHRCT-ND/729827; ROHS: YES; Quantity: 0
  R1 R2 R4 R10: Tolerance: ±1%; Package / Case: 0603
R3 R8 R9 = SRES02030001: RES SMD 0.0 OHM JUMPER 1/8W 0603; Tolerance: 0; Power (Watts): 0.125W, 1/8W; Distrubutor: Digikey; Part Number: SRES02030001; Package / Case: 0603; Resistance (Ohm): 0; Category: Resistors; Family: Chip Resistor - Surface Mount; ROHS: YES
R5-R7 R12 = SRES02000074: RES SMD 1K OHM 1% 1/10W 0603; Manufacturer: Yageo; Manufacturer Part Number: RC0603FR-071KL; Power (Watts): 0.1W, 1/10W; Cost x1 ($): 0.10000; Cost x10 ($): 0.01400; Cost x100 ($): 0.00570; Cost x1000 ($): 0.00257; Distrubutor: Digikey; Lead Time: 22 Weeks; Part Number: SRES02000074; Tolerance: ±1%; Package / Case: 0603; Resistance (Ohm): 1K; Category: Resistors; Family: Chip Resistor - Surface Mount; Distributor Part Number: 311-1.00KHRCT-ND; Distributor Link: http://www.digikey.com/product-detail/en/yageo/RC0603FR-071KL/311-1.00KHRCT-ND/729790; ROHS: YES; Quantity: 0
R11 = SRES02000114: RES SMD 47K OHM 1% 1/10W 0603; Manufacturer: Yageo; Manufacturer Part Number: RC0603FR-0747KL; Power (Watts): 0.1W, 1/10W; Cost x1 ($): 0.10000; Cost x10 ($): 0.01400; Cost x100 ($): 0.00570; Cost x1000 ($): 0.00257; Distrubutor: Digikey; Lead Time: 22 Weeks; Part Number: SRES02000114; Resistance (Ohm): 47K; Category: Resistors; Family: Chip Resistor - Surface Mount; Distributor Part Number: 311-47.0KHRCT-ND; Distributor Link: http://www.digikey.com/product-detail/en/yageo/RC0603FR-0747KL/311-47.0KHRCT-ND/730200; ROHS: YES; Quantity: 0
SW1 = SSWI00022: SWITCH TACTILE SPST-NO 0.05A 12V; Manufacturer: C&K Components; Manufacturer Part Number: RS-282G05A3-SM RT; Value: SWITCH_TACTILE_MICRO_2PIN; Voltage: 12VDC; Cost x10 ($): 0.72900; Cost x100 ($): 0.55000; Cost x1000 ($): 0.39875; Distrubutor: Digikey; Lead Time: 10 Weeks; Cost x1 ($): 0.76000; Part Number: SSWI00022; Current: 0.05A; Package: SMD; Category: Switches; Family: Tactile Switches; Circuit: SPST-NO; Distributor Part Number: CKN10384CT-ND; Distrubutor Link: http://www.digikey.com/product-detail/en/c-k-components/RS-282G05A3-SM-RT/CKN10384CT-ND/2747203; ROHS: YES; Moisture Sensitivity Level (MSL): 1 (Unlimited); Datasheet Link: 0
X1 = SCRY00014: CRYSTAL 13.5600MHZ 12PF T/H; Manufacturer: TXC CORPORATION; Manufacturer Part Number: 9B-13.560MAAE-B; Frequency Tolerance: ±30ppm; ESR: 40 Ohm; Distrubutor: Digikey; Lead Time: 13 Weeks; Cost x10 ($): 0.30000; Cost x100 ($): 0.24000; Cost x1000 ($): 0.19200; Cost x1 ($): 0.36000; Part Number: SCRY00014; Mounting Type: Through Hole; Load Capacitance: 12pF; Package / Case: HC49/US; Type: MHz Crystal; Distributor Part Number: 887-2013-ND; ROHS: YES; Datasheet Link: http://www.digikey.com/product-detail/en/9B-13.560MAAE-B/887-2013-ND/3522046; Quantity: 10